# EAGLE design IN-1 Module (EAGLE 7.7.0)
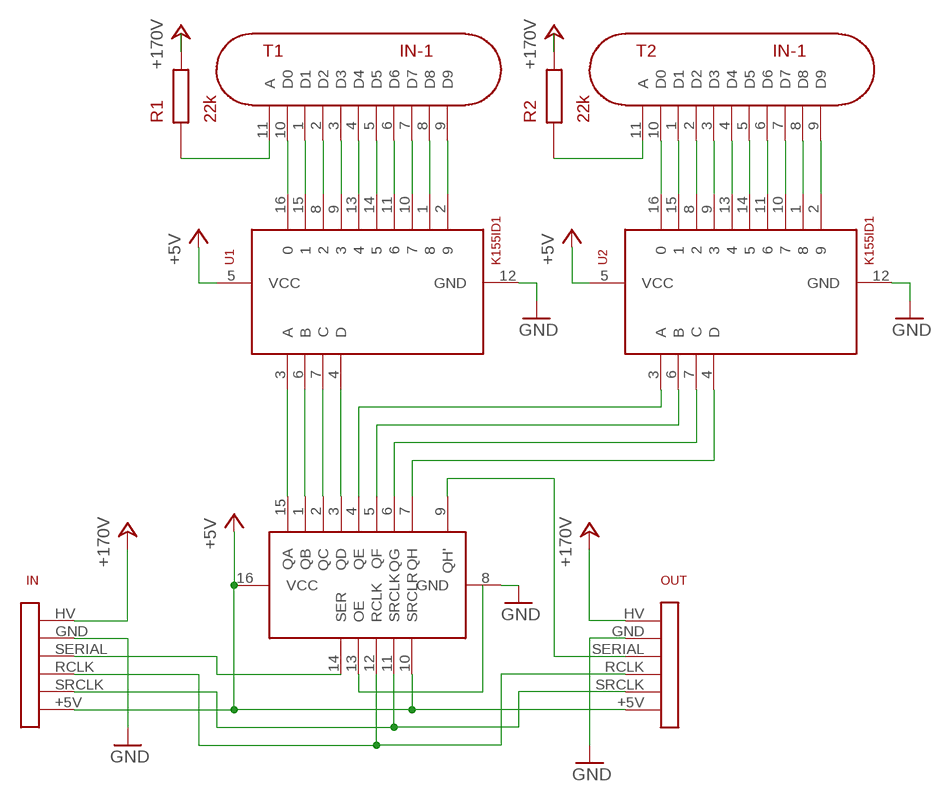
[diagram p0: schematic, sheet 1]

## Parts
IN  NIXIE_INTERCONNECT  [NIXIE_INTERCONNECT]
OUT  NIXIE_INTERCONNECT  [NIXIE_INTERCONNECT]
R1  22k  ANODE_RESISTOR  [ANODE_RESISTOR]
R2  22k  ANODE_RESISTOR  [ANODE_RESISTOR]
T1  IN-1  [IN-1]
T2  IN-1  [IN-1]
U1  K155ID1  [DIP16-2.54-19.2X7.62MM]
U2  K155ID1  [DIP16-2.54-19.2X7.62MM]
U3  74HC595  [DIL16]

## Nets
+5V: IN.+5V OUT.+5V U1.5(VCC) U2.5(VCC) U3.10(SRCLR) U3.16(VCC)
+24V: IN.HV OUT.HV R1.P$2 R2.P$2 ; supply symbol labelled +170V
GND: IN.GND OUT.GND U1.12(GND) U2.12(GND) U3.8(GND)
N$1: R1.P$1 T1.11(A)
N$2: T1.10(D0) U1.16
N$3: T1.1(D1) U1.15
N$4: T1.2(D2) U1.8
N$5: T1.3(D3) U1.9
N$6: T1.4(D4) U1.13
N$7: T1.5(D5) U1.14
N$8: T1.6(D6) U1.11
N$9: T1.7(D7) U1.10
N$10: T1.8(D8) U1.1
N$11: T1.9(D9) U1.2
N$12: R2.P$1 T2.11(A)
N$13: T2.10(D0) U2.16
N$14: T2.1(D1) U2.15
N$15: T2.2(D2) U2.8
N$16: T2.3(D3) U2.9
N$17: T2.4(D4) U2.13
N$18: T2.5(D5) U2.14
N$19: T2.6(D6) U2.11
N$20: T2.7(D7) U2.10
N$21: T2.8(D8) U2.1
N$22: T2.9(D9) U2.2
N$25: OUT.SERIAL U3.9(QH')
N$26: IN.SERIAL U3.14(SER)
N$27: IN.RCLK OUT.RCLK U3.12(RCLK)
N$29: IN.SRCLK OUT.SRCLK U3.11(SRCLK)
N$45: U3.13(OE)
N$67: U1.3(A) U3.15(QA)
N$68: U1.6(B) U3.1(QB)
N$69: U1.7(C) U3.2(QC)
N$70: U1.4(D) U3.3(QD)
N$71: U2.3(A) U3.4(QE)
N$72: U2.6(B) U3.5(QF)
N$73: U2.7(C) U3.6(QG)
N$74: U2.4(D) U3.7(QH)

## Library data of the parts
IN OUT = TimeExpander:NIXIE_INTERCONNECT
R1 R2 = TimeExpander:ANODE_RESISTOR: Anode resistor (Value is depending on drive voltage)
T1 T2 = TimeExpander:IN-1: Soviet IN-1 Nixie Tube
U1 U2 = TimeExpander:K155ID1: Soviet version of SN74141 BCD to Decimal Decoder / Nixie Driver
U3 = TimeExpander:74HC595: 8-Bit Shift Register

## Board
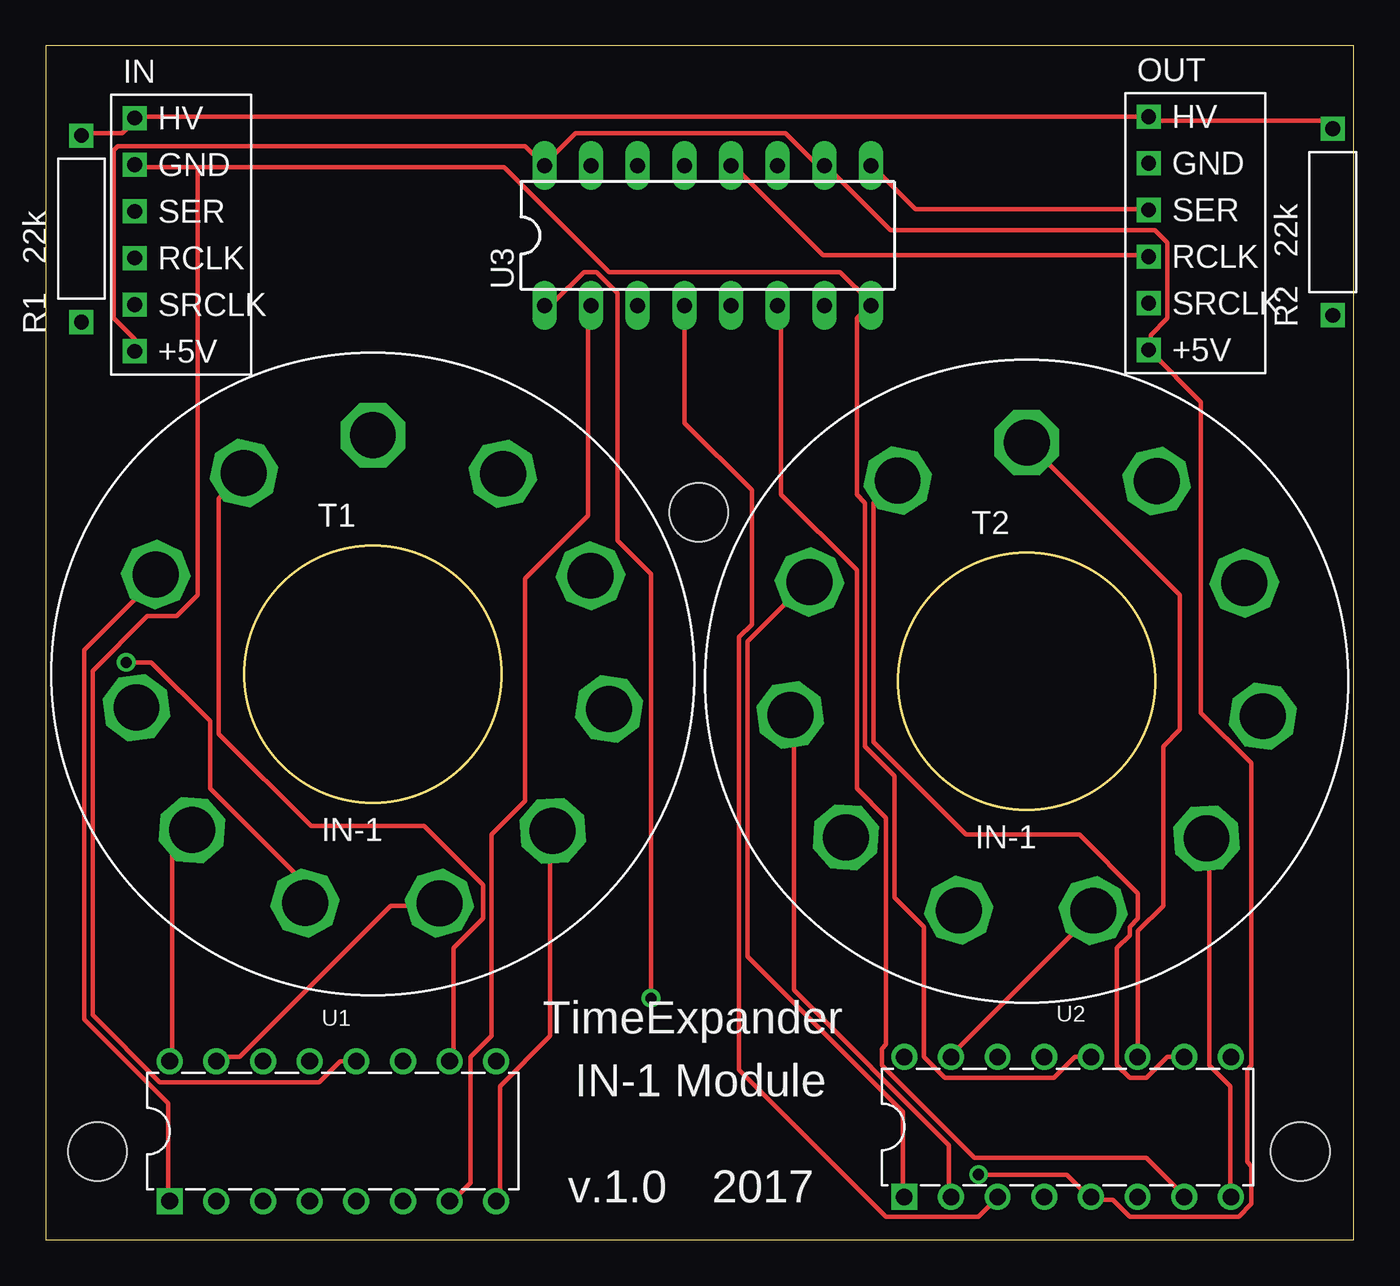
[diagram p1: board, top side]
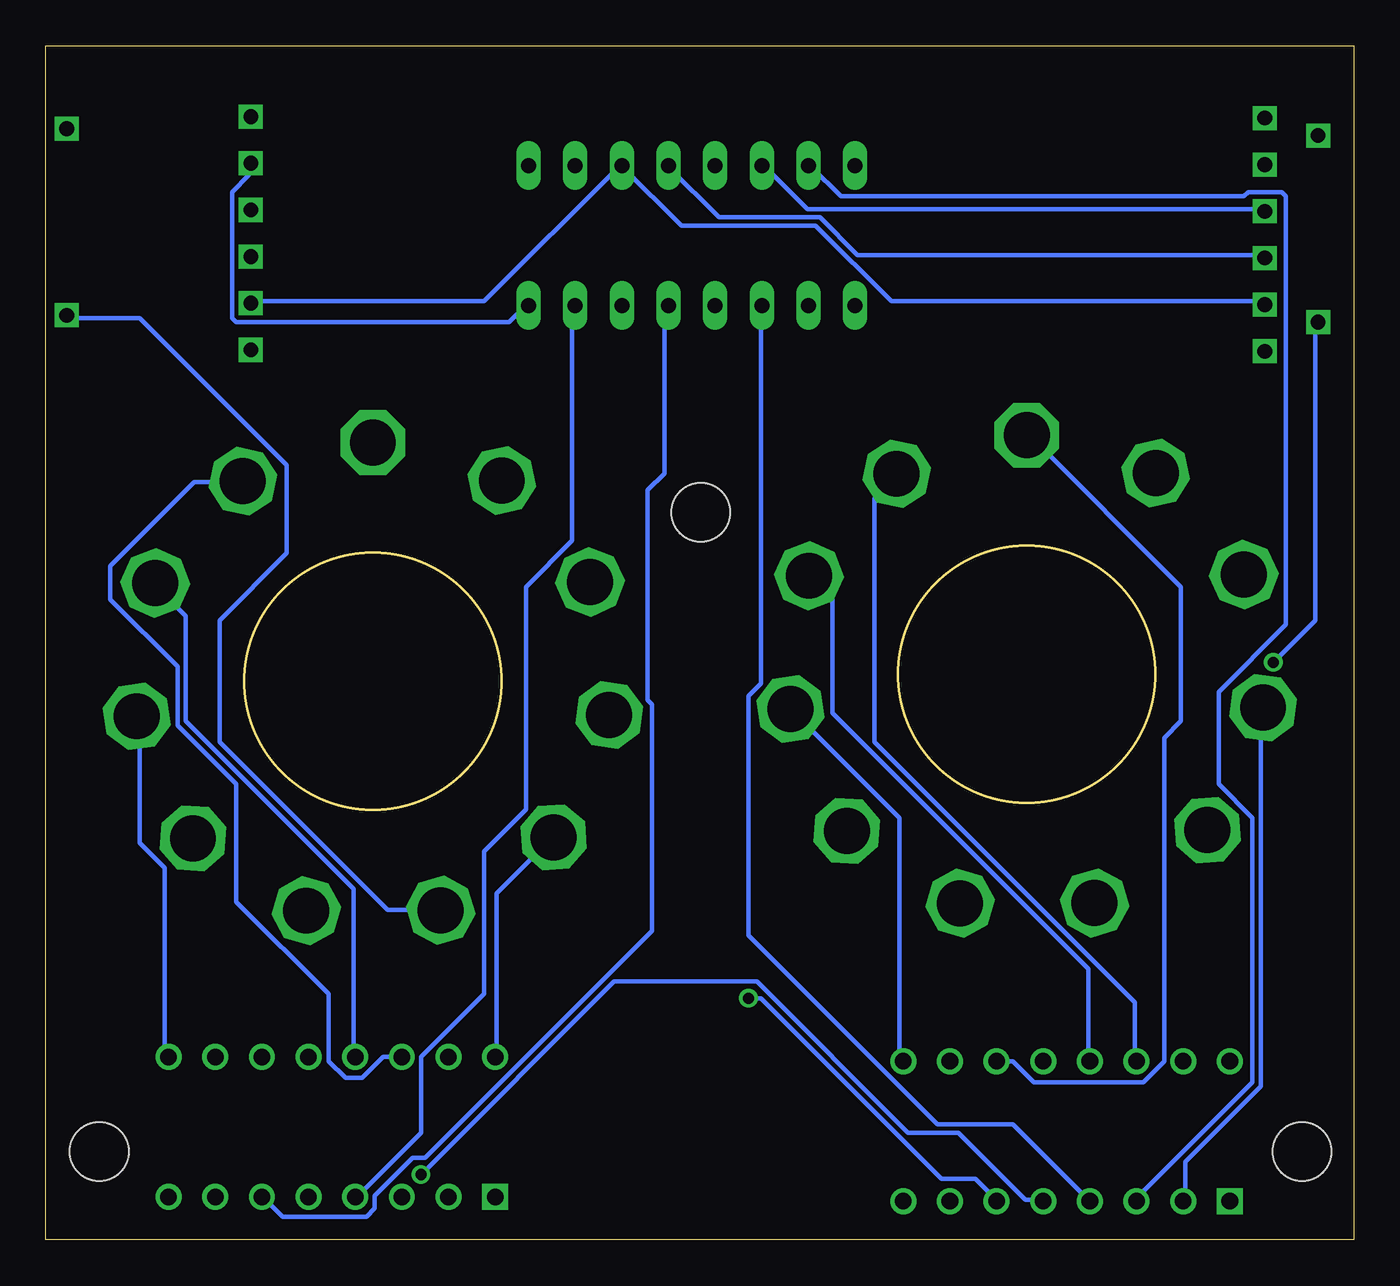
[diagram p2: board, bottom side, seen from below]

Size 71.2 x 65 mm. Coordinates in mm from the lower left corner, seen from the top.
Outline: 0,0 71.2,0 71.2,65 0,65 0,0
Copper layers (1*16): Top 0.035mm / dielectric 1.5mm / Bottom 0.035mm
Design rules "default": minimum track width 10mil, minimum drill 24mil, track to track 8mil, track to pad 8mil, pad to pad 8mil, via to via 8mil, smd to smd 8mil, copper to edge 40mil, drill to drill 8mil, minimum pad ring 10mil, minimum via ring 8mil, stop-mask expansion 4mil, vias tented up to drill 0mil, thermal gap 10mil
Holes 3.2 mm at 2.8,4.8 68.3,4.8 35.55,39.6

### Footprints (pad centres in the part's own frame; a part is rotated, then mirrored left to right if it is on the bottom)
NIXIE_INTERCONNECT = drill 0.8 square: +5V -10.16,-7.62; GND -10.16,2.54; HV -10.16,5.08; RCLK -10.16,-2.54; SERIAL -10.16,0; SRCLK -10.16,-5.08
ANODE_RESISTOR = drill 0.8 square: P$1 0,0; P$2 10.16,0
IN-1 = drill 2.5 octagon: 1 3.627,-12.484; 2 9.796,-8.546; 3 12.861,-1.899; 4 11.848,5.35; 5 7.08,10.903; 6 0,13; 7 -7.023,10.94; 8 -11.82,5.412; 9 -12.87,-1.832; 10 -9.841,-8.494; 11 -3.692,-12.465
DIP16-2.54-19.2X7.62MM = drill 0.9 pad 1.4 square: 1 -8.89,-3.81 | drill 0.9 pad 1.4: 2 -6.35,-3.81; 3 -3.81,-3.81; 4 -1.27,-3.81; 5 1.27,-3.81; 6 3.81,-3.81; 7 6.35,-3.81; 8 8.89,-3.81; 9 8.89,3.81; 10 6.35,3.81; 11 3.81,3.81; 12 1.27,3.81; 13 -1.27,3.81; 14 -3.81,3.81; 15 -6.35,3.81; 16 -8.89,3.81
DIL16 = drill 0.813 long: 1 -8.89,-3.81; 2 -6.35,-3.81; 3 -3.81,-3.81; 4 -1.27,-3.81; 5 1.27,-3.81; 6 3.81,-3.81; 7 6.35,-3.81; 8 8.89,-3.81; 9 8.89,3.81; 10 6.35,3.81; 11 3.81,3.81; 12 1.27,3.81; 13 -1.27,3.81; 14 -3.81,3.81; 15 -6.35,3.81; 16 -8.89,3.81

### Placement (x,y rotation side)
IN  14.99,55.99 0 top
OUT  70.2,56.07 0 top
R1  1.93,49.96 90 top
R2  70.07,50.33 90 top
T1  17.8,30.8 0 top
T2  53.4,30.4 0 top
U1  15.63,5.91 0 top
U2  55.63,6.14 0 top
U3  36.03,54.68 0 top

### Tracks (layer width: path | path; a pad name or v marks a point on that pad's centre or on a via)
+5V  (via drill 0.61)
  Top 0.254: v50.78,3.54 55.58,3.54 56.72,2.4 U2.5 56.95,2.17 58.09,2.17 59.01,1.26 64.95,1.26 65.64,1.94 65.64,4 65.41,4.23 65.41,9.26 65.64,9.49 65.64,25.95 62.89,28.69 62.89,45.61 60.15,48.35 OUT.+5V 60.15,48.58 60.15,49.26 61.06,50.18 61.06,54.29 60.38,54.98 45.98,54.98 42.55,58.41 U3.10 42.32,58.64 41.86,58.64 40.26,60.24 28.83,60.24 27.23,58.64 U3.16 27,58.64 26.09,59.55 3.92,59.55 3.69,59.32 3.69,50.18 4.83,49.04 4.83,48.58 IN.+5V
  Bottom 0.254: v50.78,3.54 40.26,14.06 32.49,14.06 24.26,5.83 21.52,5.83 17.86,2.17 16.95,2.17 U1.5
+24V
  Top 0.254: R1.P$2 2.09,60.24 4.14,60.24 4.83,60.92 IN.HV 5.06,61.15 59.92,61.15 OUT.HV 60.15,60.92 69.75,60.92 69.98,60.69 R2.P$2
GND
  Top 0.254: 8.26,58.41 24.95,58.41 30.66,52.69 43.23,52.69 44.83,51.09 U3.8 44.83,50.86 44.15,50.18 44.15,40.58 44.61,40.12 44.61,26.86 46.21,25.26 46.21,18.63 47.81,17.03 47.81,9.95 48.95,8.8 54.89,8.8 56.04,9.95 56.72,9.95 U2.12 | 8.26,58.41 5.06,58.41 IN.GND | 8.26,58.41 8.26,35.09 7.12,33.95 5.51,33.95 2.54,30.98 2.54,12.23 6.2,8.57 14.89,8.57 16.03,9.72 16.72,9.72 U1.12
  Bottom 0.254: OUT.GND 60.15,58.41 60.15,57.95 61.06,57.04 61.06,50.18 60.84,49.95 45.98,49.95 45.06,50.86 U3.8
N$1  (via drill 0.61)
  Top 0.254: v4.37,31.43 5.74,31.43 8.94,28.23 8.94,24.57 13.97,19.55 13.97,18.4 T1.11
  Bottom 0.254: v4.37,31.43 2.09,33.72 2.09,49.95 R1.P$1
N$2
  Top 0.254: U1.16 6.89,9.95 6.89,21.38 7.8,22.29 T1.10
N$3
  Top 0.254: U1.15 9.4,9.95 10.54,9.95 18.77,18.18 21.29,18.18 T1.1
N$4
  Top 0.254: U1.8 24.72,2.17 24.72,8.34 27.46,11.09 27.46,22.06 T1.2
N$5
  Bottom 0.254: U1.9 24.72,9.95 24.72,22.98 30.43,28.69 T1.3
N$6
  Bottom 0.254: U1.13 14.43,9.95 14.43,14.75 28.38,28.69 28.38,34.86 29.52,36 T1.4
N$7
  Bottom 0.254: U1.14 11.92,9.95 11.92,12.92 26.09,27.09 26.09,40.35 24.95,41.49 T1.5
N$8
  Bottom 0.254: U1.11 19.23,9.72 18.55,9.72 17.4,8.57 11.46,8.57 10.32,9.72 10.32,27.32 9.4,28.23 9.4,35.55 17.63,43.78 T1.6
N$9
  Top 0.254: U1.10 22.2,9.95 22.2,15.89 23.8,17.49 23.8,19.32 20.6,22.52 14.43,22.52 9.4,27.55 9.4,40.35 10.77,41.72 T1.7
N$10
  Top 0.254: U1.1 6.66,2.17 6.66,7.43 2.09,12 2.09,32.12 5.97,36 T1.8
N$11
  Bottom 0.254: U1.2 9.17,2.17 9.17,4.23 5.06,8.34 5.06,28.92 T1.9
N$12
  Bottom 0.254: R2.P$1 69.98,50.18 66.09,50.18 58.09,42.18 58.09,37.38 61.75,33.72 61.75,27.09 52.61,17.95 49.86,17.95 T2.11
N$13
  Bottom 0.254: U2.16 46.66,10.17 46.66,18.86 43.69,21.83 T2.10
N$14
  Top 0.254: U2.15 49.41,10.17 56.95,17.72 T2.1
N$15
  Top 0.254: U2.8 64.49,2.4 64.49,8.34 63.35,9.49 63.35,21.83 T2.2
N$16
  Bottom 0.254: U2.9 64.72,10.17 64.72,20.23 66.09,21.6 66.09,28.46 T2.3
N$17
  Bottom 0.254: U2.13 54.43,10.17 54.43,19.09 63.58,28.23 63.58,33.95 65.18,35.55 T2.4
N$18
  Bottom 0.254: U2.14 51.92,9.95 52.83,9.95 53.98,8.8 54.89,8.8 55.81,9.72 55.81,13.37 60.84,18.4 60.84,24.8 64.04,28 64.04,31.21 67.69,34.86 67.69,36.69 63.12,41.26 60.61,41.26 T2.5
N$19
  Top 0.254: U2.11 59.46,10.17 59.46,16.8 60.84,18.18 60.84,26.86 61.75,27.78 61.75,35.09 53.52,43.32 T2.6
N$20
  Top 0.254: U2.10 61.06,9.95 59.92,8.8 59.01,8.8 58.32,9.49 58.32,15.89 59.01,16.57 59.01,17.03 59.46,17.49 59.46,18.86 56.26,22.06 50.09,22.06 45.06,27.09 45.06,40.12 46.21,41.26 T2.7
N$21
  Top 0.254: U2.1 46.66,2.4 46.66,6.97 38.2,15.43 38.2,32.58 41.4,35.78 T2.8
N$22
  Top 0.254: U2.2 49.18,2.4 49.18,5.14 40.72,13.6 40.72,28.46 T2.9
N$25
  Top 0.254: OUT.SERIAL 59.92,56.12 47.35,56.12 45.06,58.41 U3.9
N$26
  Bottom 0.254: IN.SERIAL 5.06,56.12 29.75,56.12 32.03,58.41 U3.14
N$27
  Top 0.254: OUT.RCLK 59.92,53.61 42.32,53.61 37.52,58.41 U3.12
  Bottom 0.254: IN.RCLK 5.06,53.61 27,53.61 29.06,55.66 34.55,55.66 37.29,58.41 U3.12
N$29
  Bottom 0.254: IN.SRCLK 5.06,51.09 25.18,51.09 29.29,55.21 36.6,55.21 39.8,58.41 U3.11 40.03,58.41 47.35,51.09 59.92,51.09 OUT.SRCLK
N$67
  Bottom 0.254: U3.15 29.52,58.41 27.92,56.81 5.97,56.81 5.74,57.04 3.92,57.04 3.69,56.81 3.69,33.49 7.34,29.83 7.34,24.8 5.51,22.98 5.51,8.57 11.92,2.17 U1.3
N$68  (via drill 0.61)
  Top 0.254: v32.95,13.14 32.95,36.23 31.12,38.06 31.12,51.55 29.98,52.69 29.29,52.69 27.69,51.09 27.23,51.09 U3.1
  Bottom 0.254: v32.95,13.14 32.26,13.14 22.43,3.32 20.6,3.32 19.46,2.17 U1.6
N$69
  Top 0.254: U3.2 29.52,50.86 29.52,39.43 26.09,36 26.09,23.89 24.26,22.06 24.26,11.09 23.12,9.95 23.12,3.09 22.2,2.17 U1.7
N$70
  Bottom 0.254: U3.3 32.26,50.86 32.26,30.29 32.95,29.61 32.95,16.57 22.66,6.29 18.55,6.29 14.43,2.17 U1.4
N$71
  Top 0.254: U3.4 34.78,50.86 34.78,44.46 38.43,40.81 38.43,33.49 37.75,32.8 37.75,9.26 45.75,1.26 50.78,1.26 51.69,2.17 U2.3
N$72
  Bottom 0.254: U3.5 37.52,50.86 37.52,41.72 38.43,40.81 38.43,29.38 38.2,29.15 38.2,16.8 50.55,4.46 51.23,4.46 53.29,2.4 53.29,1.71 53.75,1.26 58.32,1.26 59.24,2.17 U2.6
N$73
  Top 0.254: U3.6 40.03,50.86 40.03,40.58 44.15,36.46 44.15,24.57 45.75,22.98 45.75,10.63 45.52,10.4 45.52,9.49 50.55,4.46 59.92,4.46 61.98,2.4 U2.7
N$74
  Bottom 0.254: U3.7 42.55,50.86 42.55,38.06 45.06,35.55 45.06,23.43 47.35,21.15 47.35,13.37 50.78,9.95 50.78,5.83 54.21,2.4 U2.4

### Text on the board
tPlace: TimeExpander | IN-1 Module | v.1.0 | 2017